# EAGLE design LED_Matrix (EAGLE 7.1.0)
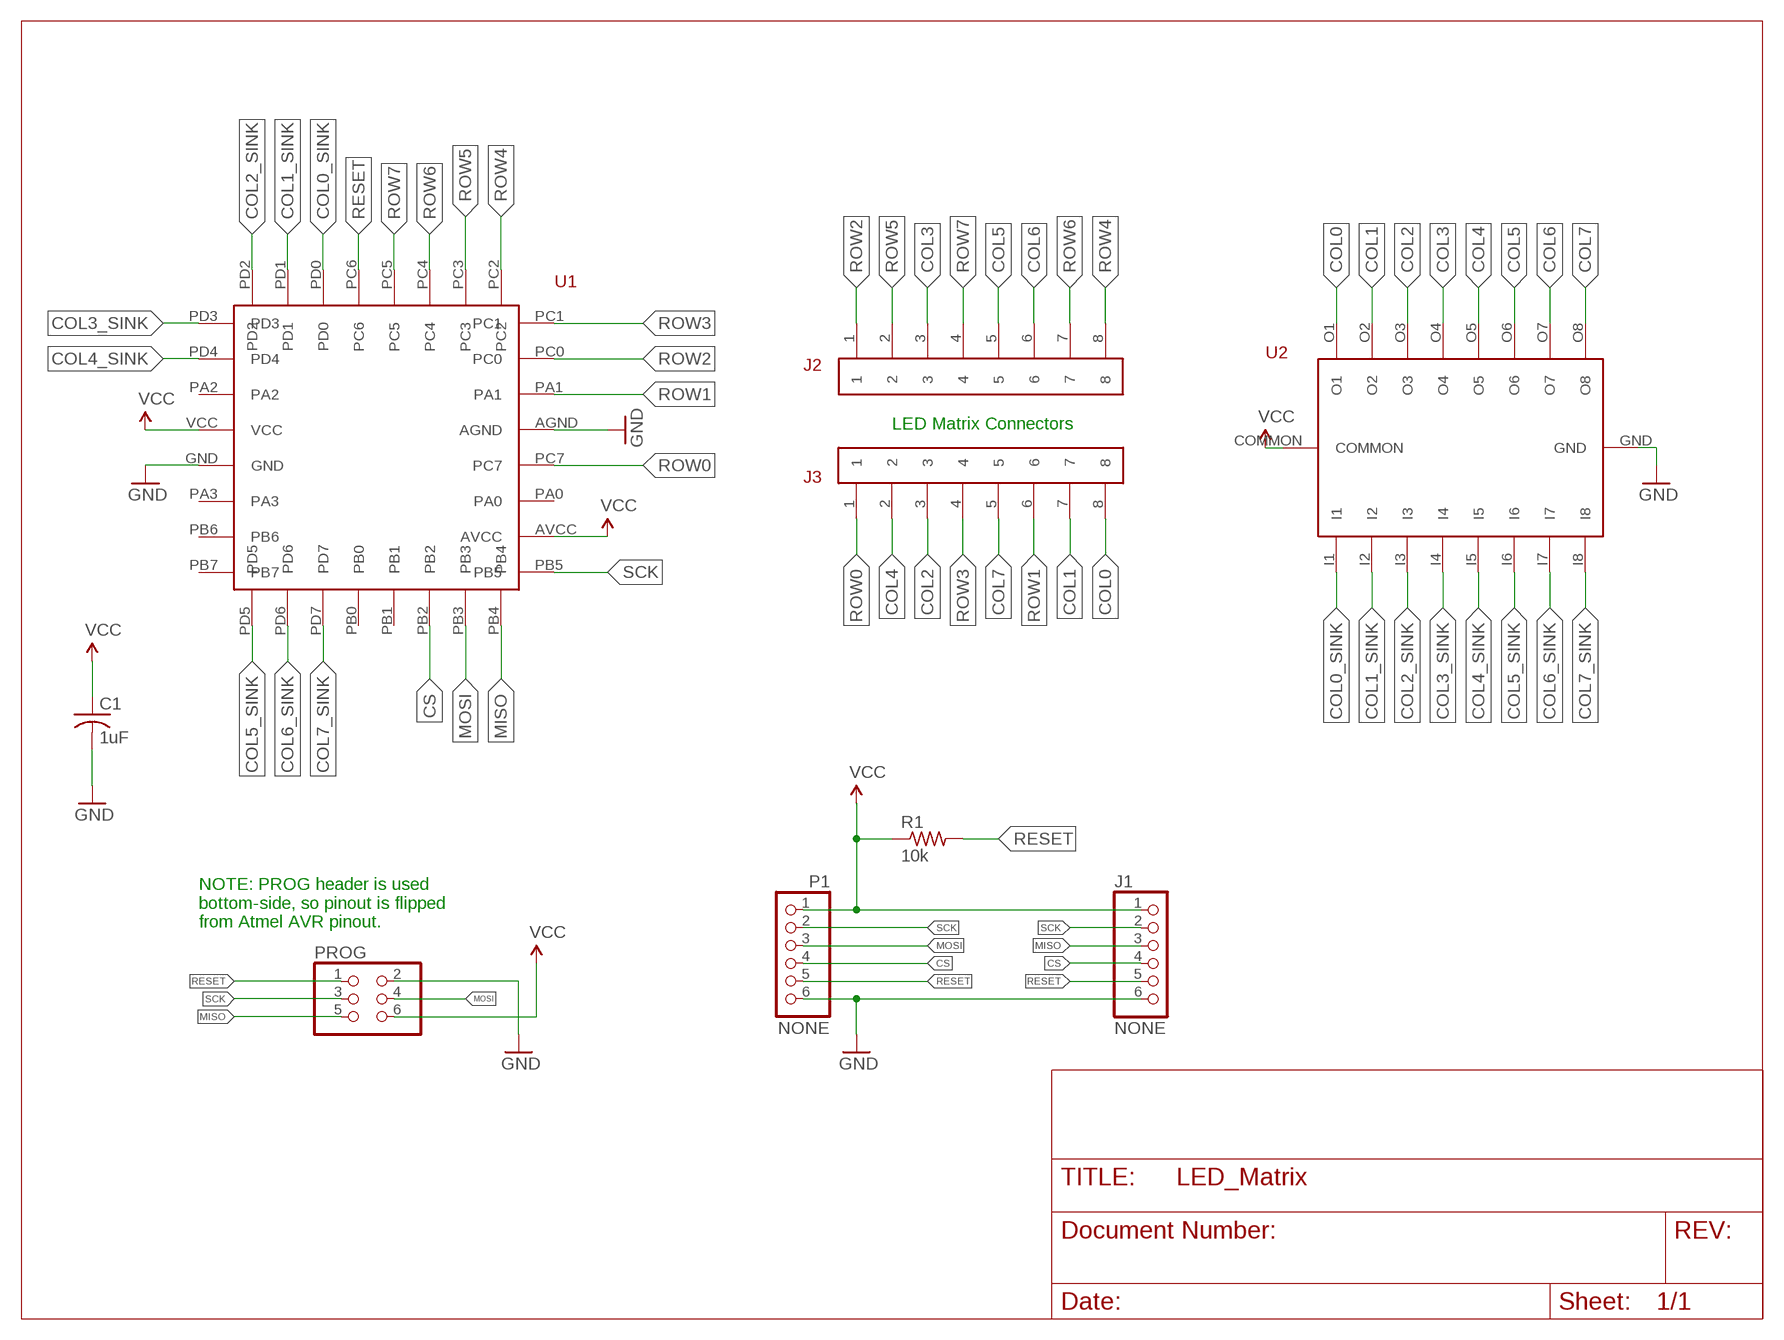
[diagram p0: schematic, sheet 1]

## Parts
C1  1uF  C-USC0603  [C0603]
J1  NONE  PINHD-1X6  [1X06]
J2  HEADER-1X8  [HEADER-1X8]
J3  HEADER-1X8  [HEADER-1X8]
P1  NONE  PINHD-1X6  [1X06]
PROG  NONE  PINHD-2X3  [2X03]
R1  10k  R-US_R0603  [R0603]
U1  ATTINY48  [ATTINY48]
U2  ULN2803AFWG  [ULN2803AFWG]

## Nets
COL0: J3.8 U2.O1
COL0_SINK: U1.PD0 U2.I1
COL1: J3.7 U2.O2
COL1_SINK: U1.PD1 U2.I2
COL2: J3.3 U2.O3
COL2_SINK: U1.PD2 U2.I3
COL3: J2.3 U2.O4
COL3_SINK: U1.PD3 U2.I4
COL4: J3.2 U2.O5
COL4_SINK: U1.PD4 U2.I5
COL5: J2.5 U2.O6
COL5_SINK: U1.PD5 U2.I6
COL6: J2.6 U2.O7
COL6_SINK: U1.PD6 U2.I7
COL7: J3.5 U2.O8
COL7_SINK: U1.PD7 U2.I8
CS: J1.4 P1.4 U1.PB2
GND: C1.2 J1.6 P1.6 PROG.2 U1.AGND U1.GND U2.GND
MISO: J1.3 PROG.5 U1.PB4
MOSI: P1.3 PROG.4 U1.PB3
RESET: J1.5 P1.5 PROG.1 R1.2 U1.PC6
ROW0: J3.1 U1.PC7
ROW1: J3.6 U1.PA1
ROW2: J2.1 U1.PC0
ROW3: J3.4 U1.PC1
ROW4: J2.8 U1.PC2
ROW5: J2.2 U1.PC3
ROW6: J2.7 U1.PC4
ROW7: J2.4 U1.PC5
SCK: J1.2 P1.2 PROG.3 U1.PB5
VCC: C1.1 J1.1 P1.1 PROG.6 R1.1 U1.AVCC U1.VCC U2.COMMON
Unconnected: U1.PA0 U1.PA2 U1.PA3 U1.PB0 U1.PB1 U1.PB6 U1.PB7

## Notes on the sheet
- LED Matrix Connectors
- NOTE: PROG header is used 
  bottom-side, so pinout is flipped 
  from Atmel AVR pinout.

## Library data of the parts
C1 = resistor:C-US: CAPACITOR, American symbol
J1 P1 = LED_Matrix:PINHD-1X6: PIN HEADER
J2 J3 = LED_Matrix:HEADER-1X8
PROG = LED_Matrix:PINHD-2X3: PIN HEADER
R1 = resistor:R-US_: RESISTOR, American symbol
U1 = LED_Matrix:ATTINY48
U2 = LED_Matrix:ULN2803AFWG

## Net classes
1 power: width 0.305 mm

## Board
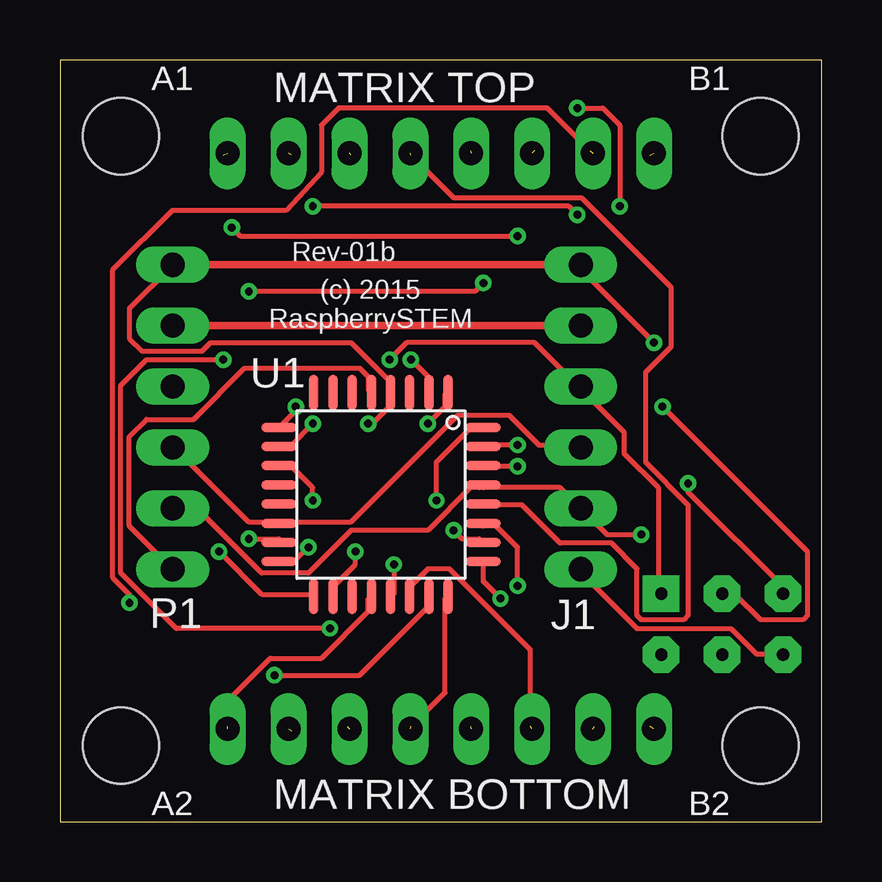
[diagram p1: board, top side]
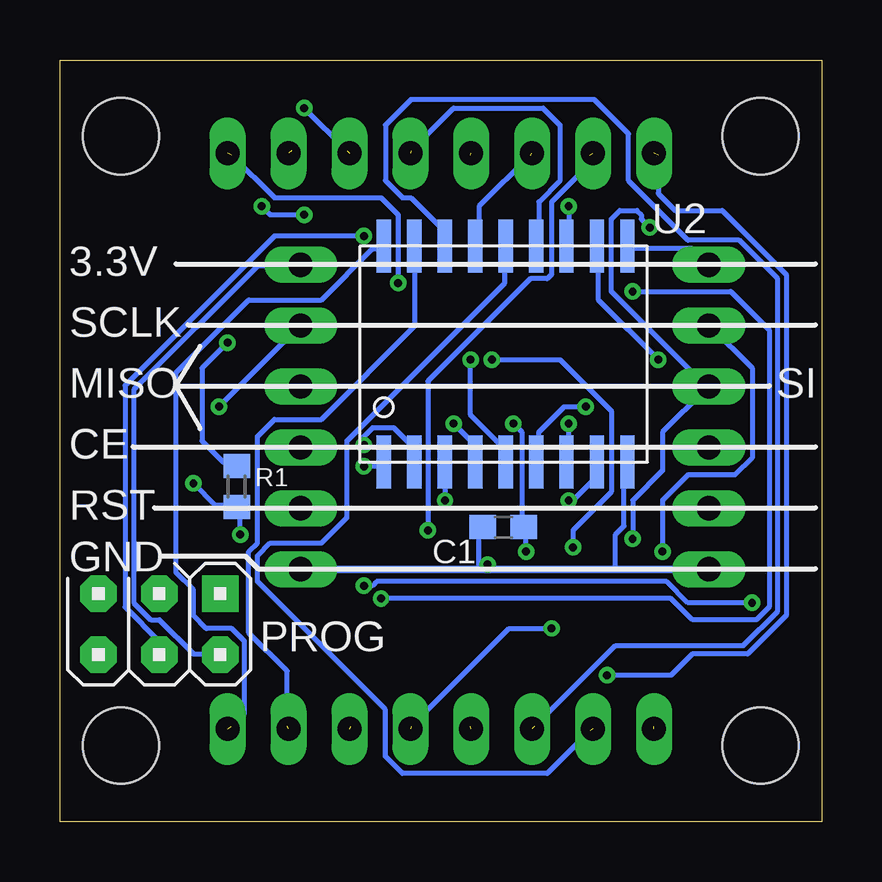
[diagram p2: board, bottom side, seen from below]

Size 31.75 x 31.75 mm. Coordinates in mm from the lower left corner, seen from the top.
Outline: 0,0 31.75,0 31.75,31.75 0,31.75 0,0
Copper layers (1*16): Top 0.0356mm / dielectric 1.5011mm / Bottom 0.0356mm
Design rules "LaenPCBOrder *": minimum track width 8mil, minimum drill 13mil, track to track 6mil, track to pad 6mil, pad to pad 6mil, via to via 6mil, smd to smd 6mil, copper to edge 15mil, drill to drill 6mil, minimum pad ring 7mil, minimum via ring 7mil, stop-mask expansion 3mil, vias tented up to drill 0mil, thermal gap 10mil
Holes 3.17 mm at 2.54,3.17 2.54,28.57 29.21,28.57 29.21,3.17
tRestrict: area 0,0 to 6.1,6.1; area 0,25.7 to 6.1,31.8; area 25.7,25.7 to 31.8,31.8; area 25.7,0 to 31.8,6.1
bRestrict: area 0,0 to 6.1,6.1; area 25.7,25.7 to 31.8,31.8; area 0,25.7 to 6.1,31.8; area 25.7,0 to 31.8,6.1
vRestrict: area 0,0 to 6.1,6.1; area 0,25.7 to 6.1,31.8; area 25.7,25.7 to 31.8,31.8; area 25.7,0 to 31.8,6.1; area 27.8,10 to 31.8,24.1; area 0,17.3 to 2.3,19.3

### Footprints (pad centres in the part's own frame; a part is rotated, then mirrored left to right if it is on the bottom)
C0603 = smd 1.1 x 1: 1 -0.85,0; 2 0.85,0
1X06 = drill 1.016 long: 1 -6.35,0; 2 -3.81,0; 3 -1.27,0; 4 1.27,0; 5 3.81,0; 6 6.35,0
HEADER-1X8 = drill 1 long: 1 -8.89,0; 2 -6.35,0; 3 -3.81,0; 4 -1.27,0; 5 1.27,0; 6 3.81,0; 7 6.35,0; 8 8.89,0
2X03 = drill 0.508 pad 1.524 octagon: 1 -2.54,-1.27; 2 -2.54,1.27; 3 0,-1.27; 4 0,1.27; 6 2.54,1.27 | drill 0.508 pad 1.524 square: 5 2.54,-1.27
R0603 = smd 1 x 1.1: 1 -0.85,0; 2 0.85,0
ATTINY48 = smd 1.5 x 0.406: AGND 4.25,0.4; AVCC 4.25,-2; GND -4.25,-0.4; PA0 4.25,-1.2; PA1 4.25,1.2; PA2 -4.25,1.2; PA3 -4.25,-1.2; PB5 4.25,-2.8; PB6 -4.25,-2; PB7 -4.25,-2.8; PC0 4.25,2; PC1 4.25,2.8; PC7 4.25,-0.4; PD3 -4.25,2.8; PD4 -4.25,2; VCC -4.25,0.4 | smd 0.406 x 1.5: PB0 -0.4,-4.25; PB1 0.4,-4.25; PB2 1.2,-4.25; PB3 2,-4.25; PB4 2.8,-4.25; PC2 2.8,4.25; PC3 2,4.25; PC4 1.2,4.25; PC5 0.4,4.25; PC6 -0.4,4.25; PD0 -1.2,4.25; PD1 -2,4.25; PD2 -2.8,4.25; PD5 -2.8,-4.25; PD6 -2,-4.25; PD7 -1.2,-4.25
ULN2803AFWG = smd 0.6 x 2.2: COMMON 10.16,9.01; GND 10.16,0; I1 0,0; I2 1.27,0; I3 2.54,0; I4 3.81,0; I5 5.08,0; I6 6.35,0; I7 7.62,0; I8 8.89,0; O1 0,9.01; O2 1.27,9.01; O3 2.54,9.01; O4 3.81,9.01; O5 5.08,9.01; O6 6.35,9.01; O7 7.62,9.01; O8 8.89,9.01

### Placement (x,y rotation side)
C1  13.27,12.28 180 bottom
J1  21.72,16.87 270 top
J2  15.88,27.86 0 top
J3  15.88,3.86 0 top
P1  4.7,16.87 270 top
PROG  27.61,8.23 180 top
R1  24.38,13.97 270 bottom
U1  13.38,13.63 270 top
U2  18.25,14.98 0 bottom

### Tracks (layer width: path | path; a pad name or v marks a point on that pad's centre or on a via)
COL0  (1 unrouted)
  Bottom 0.203: 24.59,3.96 24.05,4.5 24.05,7.52 24.59,8.05 25.65,8.05 26.19,8.59 26.19,9.65 26.9,10.36 26.9,18.72 23.88,21.74 20.85,21.74 18.72,23.88 18.36,23.88 U2.O1
COL0_SINK  (via drill 0.33)
  Top 0.203: v19.07,14.81 17.65,14.81 U1.PD0
  Bottom 0.203: v19.07,14.81 18.36,14.81 U2.I1
COL1  (1 unrouted)
  Bottom 0.203: 22.28,3.96 22.28,6.27 23.88,7.87 23.88,11.25 23.52,11.61 23.52,16.05 22.81,16.76 20.85,16.76 16.94,20.68 16.94,23.88 U2.O2
COL1_SINK  (via drill 0.33)
  Top 0.203: v19.07,15.7 17.65,15.7 U1.PD1
  Bottom 0.203: v19.07,15.7 19.07,16.05 18.72,16.41 17.83,16.41 17.12,15.7 17.12,14.99 U2.I2
COL2  (1 unrouted)
  Bottom 0.203: 11.96,3.96 8.59,7.34 3.25,7.34 1.83,8.76 1.83,22.63 3.43,24.23 5.56,24.23 8.05,26.72 8.05,28.68 9.47,30.1 17.12,30.1 18.19,29.03 18.19,26.72 17.48,26.01 17.12,26.01 15.88,24.77 15.88,24.05 U2.O3
COL2_SINK  (via drill 0.33)
  Top 0.203: v15.7,13.39 15.7,14.99 17.12,16.41 17.48,16.41 U1.PD2
  Bottom 0.203: v15.7,13.39 15.7,14.81 U2.I3
COL3  (1 unrouted)
  Bottom 0.203: 12.14,27.79 14.28,25.65 14.28,24.05 U2.O4
COL3_SINK  (via drill 0.33)
  Top 0.203: v15.34,16.59 16.05,17.3 16.05,17.83 U1.PD3
  Bottom 0.203: v15.34,16.59 14.45,15.7 14.45,14.99 U2.I4
COL4  (1 unrouted)
  Bottom 0.203: 9.65,3.79 11.43,2.01 17.48,2.01 18.19,2.72 18.19,4.67 23.52,10.01 23.52,11.07 22.99,11.61 20.85,11.61 19.79,12.68 19.79,15.88 13.21,22.45 13.21,23.88 U2.O5
COL4_SINK  (via drill 0.33)
  Top 0.203: v14.63,19.25 15.34,18.54 15.34,18.01 U1.PD4
  Bottom 0.203: v14.63,19.25 14.63,16.94 13.21,15.52 13.21,14.99 U2.I5
COL5  (1 unrouted)
  Bottom 0.203: 17.12,27.96 15.34,29.74 11.61,29.74 10.9,29.03 10.9,26.72 11.79,25.83 11.79,24.05 U2.O6
COL5_SINK  (via drill 0.33)
  Top 0.203: v9.83,17.3 9.83,17.12 9.3,16.59 U1.PD5
  Bottom 0.203: v9.83,17.3 10.72,17.3 11.79,16.23 11.79,14.99 U2.I6
COL6  (via drill 0.33)  (1 unrouted)
  Top 0.203: v10.54,25.65 21.21,25.65 v21.57,25.3 | v23.34,25.65 23.34,29.03 22.63,29.74 v21.57,29.74
  Bottom 0.203: v10.54,25.65 10.54,24.05 U2.O7 | v21.57,25.3 22.99,25.3 v23.34,25.65 | 19.79,27.96 v21.57,29.74
COL6_SINK  (via drill 0.33)
  Top 0.203: v10.54,16.59 9.65,15.7 9.3,15.7 U1.PD6
  Bottom 0.203: v10.54,16.59 10.54,14.99 U2.I7
COL7  (via drill 0.33)  (1 unrouted)
  Top 0.203: v6.81,19.25 3.61,19.25 2.54,18.19 2.54,10.36 4.85,8.05 v11.25,8.05
  Bottom 0.203: v6.81,19.25 9.3,21.74 9.3,23.88 U2.O8 | v11.25,8.05 13.03,8.05 17.12,3.96
COL7_SINK  (via drill 0.33)
  Top 0.203: v10.54,13.39 10.54,13.92 9.65,14.81 9.3,14.81 U1.PD7
  Bottom 0.203: v10.54,13.39 10.36,13.39 9.47,14.28 9.47,14.81 U2.I8
CS
  Top 0.203: P1.4 4.85,15.52 7.87,12.5 9.12,12.5 U1.PB2 9.3,12.5 12.14,12.5 16.59,16.94 18.72,16.94 19.96,15.7 21.57,15.7 J1.4
GND  (via drill 0.33)
  Top 0.203: v13.92,10.72 13.92,9.47 U1.AGND | P1.6 2.9,12.32 2.9,16.05 3.61,16.76 5.56,16.76 7.7,18.9 12.5,18.9 12.85,18.54 12.85,18.01 U1.GND | PROG.2 30.1,6.99 29.03,6.99 27.96,8.05 24.05,8.05 21.74,10.36 J1.6
  Bottom 0.203: 14.28,10.52 14.28,12.14 C1.2 | 13.92,10.52 v13.92,10.72 | 8.59,10.52 8.59,11.96 8.23,12.32 8.23,14.81 U2.GND
  Bottom 0.305: P1.6 8.59,10.52 13.92,10.52 14.28,10.52 J1.6
MISO  (via drill 0.33)
  Top 0.203: v10.36,11.43 9.83,10.9 9.3,10.9 U1.PB4 | v13.74,19.25 14.45,19.96 19.79,19.96 21.57,18.19 J1.3 21.74,18.01 23.52,16.23 23.52,15.34 24.94,13.92 24.94,9.65 PROG.5
  Bottom 0.203: v10.36,11.43 10.36,12.14 8.76,13.74 8.76,17.12 10.9,19.25 v13.74,19.25
MOSI  (via drill 0.33)
  Top 0.203: v7.87,11.79 9.12,11.79 U1.PB3 | v19.07,24.41 7.52,24.41 v7.16,24.77
  Bottom 0.203: v7.87,11.79 7.87,13.39 6.63,14.63 6.63,16.23 4.85,18.01 P1.3 4.85,18.19 8.76,22.1 8.76,25.12 8.41,25.48 7.7,25.48 7.52,25.3 7.52,25.12 v7.16,24.77 | PROG.4 27.61,7.52 29.03,8.94 29.03,18.19 22.81,24.41 v19.07,24.41
RESET  (via drill 0.33)
  Top 0.203: P1.5 4.85,13.03 5.74,13.03 8.41,10.36 10.36,10.36 12.14,12.14 15.34,12.14 17.12,13.92 17.48,13.92 U1.PC6 17.65,13.92 20.85,13.92 J1.5 22.81,11.96 v24.23,11.96 | v26.19,14.1 26.19,13.74 30.28,9.65 PROG.1
  Bottom 0.203: v24.23,11.96 24.23,13.03 R1.2 24.41,13.21 25.3,13.21 v26.19,14.1
ROW0  (1 unrouted)
  Top 0.203: 6.99,3.96 6.99,5.03 8.76,6.81 10.9,6.81 12.85,8.76 12.85,9.3 U1.PC7
ROW1  (1 unrouted)
  Top 0.203: 19.61,3.96 19.61,7.16 16.23,10.54 15.34,10.54 14.63,9.83 14.63,9.47 U1.PA1
ROW2  (via drill 0.33)  (1 unrouted)
  Top 0.203: v8.94,6.1 12.5,6.1 15.34,8.94 15.34,9.3 U1.PC0
  Bottom 0.203: v8.94,6.1 6.27,6.1 5.38,6.99 3.07,6.99 1.47,8.59 1.47,22.81 4.14,25.48 6.1,25.48 6.81,26.19 6.81,27.79
ROW3  (1 unrouted)
  Top 0.203: 14.63,3.96 16.05,5.38 16.05,9.3 U1.PC1
ROW4  (via drill 0.33)  (1 unrouted)
  Top 0.203: v18.36,9.3 17.65,10.01 17.65,10.72 U1.PC2 | v7.87,22.1 17.3,22.1 v17.65,22.45
  Bottom 0.203: v18.36,9.3 6.27,9.3 5.38,8.41 2.72,8.41 2.18,8.94 2.18,20.5 3.79,22.1 v7.87,22.1 | v17.65,22.45 17.65,25.3 18.36,26.01 22.81,26.01 24.59,27.79
ROW5  (via drill 0.33)  (1 unrouted)
  Top 0.203: v16.41,12.14 16.76,11.79 17.48,11.79 U1.PC3
  Bottom 0.203: v16.41,12.14 16.41,18.36 12.14,22.63 11.43,22.63 11.25,22.81 11.25,25.83 9.65,27.43 9.65,27.79
ROW6  (via drill 0.33)  (1 unrouted)
  Top 0.203: v19.07,9.83 19.07,11.43 18.19,12.32 17.65,12.32 U1.PC4 | v2.9,9.12 2.9,9.47 2.18,10.19 2.18,22.99 4.67,25.48 9.42,25.48 10.9,27.08 10.9,29.03 11.61,29.74 20.32,29.74 22.1,27.96
  Bottom 0.203: v19.07,9.83 18.72,9.83 18.54,10.01 6.45,10.01 5.56,9.12 v2.9,9.12
ROW7  (1 unrouted)
  Top 0.203: 14.63,27.79 16.41,26.01 21.74,26.01 25.48,22.28 25.48,19.79 24.41,18.72 24.41,14.99 26.19,13.21 26.19,8.59 26.01,8.41 24.23,8.41 24.05,8.59 24.05,10.54 22.99,11.61 20.85,11.61 19.25,13.21 17.65,13.21 U1.PC5
SCK  (via drill 0.33)
  Top 0.203: v6.63,11.25 8.41,9.47 10.54,9.47 U1.PB5 | v25.12,17.3 31.17,11.25 31.17,8.59 30.99,8.41 29.21,8.41 28.14,9.47 27.61,9.47 PROG.3
  Top 0.305: P1.2 J1.2
  Bottom 0.203: v6.63,11.25 6.63,13.39 5.56,14.45 3.61,14.45 2.9,15.16 2.9,18.9 4.67,20.68 P1.2 | v25.12,17.3 21.74,20.68 J1.2
VCC  (via drill 0.33)
  Top 0.203: v12.32,11.25 12.32,10.72 11.43,9.83 11.43,9.47 U1.AVCC | v24.77,19.96 21.57,23.16 J1.1 | P1.1 4.67,23.16 2.9,21.39 2.9,20.14 3.43,19.61 5.92,19.61 6.27,19.96 12.14,19.96 13.74,18.36 13.74,18.01 U1.VCC 13.74,17.83 13.74,17.3 13.03,16.59 v12.85,16.59
  Top 0.305: P1.1 J1.1
  Bottom 0.203: v12.32,11.25 12.32,12.14 C1.1 12.5,12.32 12.5,16.23 v12.85,16.59 | v24.77,19.96 25.83,18.9 25.83,15.88 24.94,14.99 24.41,14.99 R1.1 | U2.COMMON 8.05,23.88 5.38,23.88 4.85,23.34 P1.1 | PROG.6 25.12,6.99 26.19,6.99 27.61,8.41 27.96,8.41 28.68,9.12 28.68,18.01 23.52,23.16 21.74,23.16 J1.1

### Text on the board
tPlace: A1 | B1 | MATRIX TOP | Rev-01b | (c) 2015 / RaspberrySTEM | MATRIX BOTTOM | A2 | B2
bPlace: 3.3V | SCLK | SI | MISO | CE | RST | GND